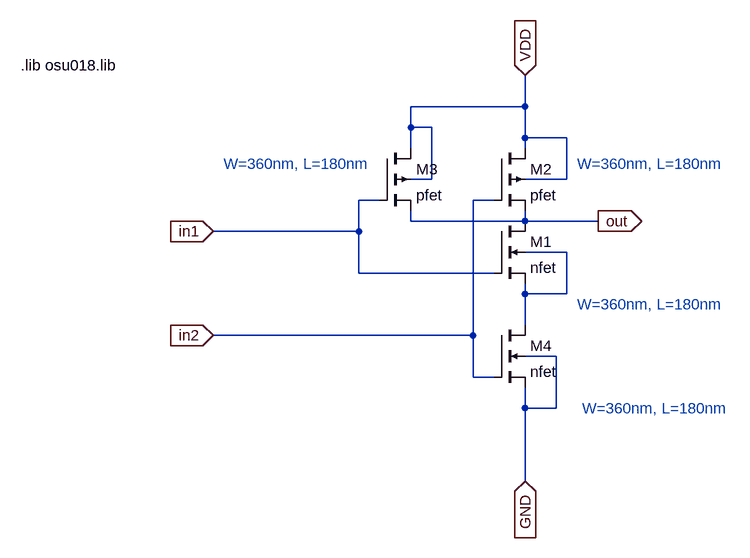
[diagram p0: schematic nand101.asc]
nand101.asc, the LTspice schematic file:
Version 4
SHEET 1 880 708
WIRE 272 0 272 -48
WIRE 272 0 96 0
WIRE 96 32 96 0
WIRE 128 32 96 32
WIRE 272 48 272 0
WIRE 336 48 272 48
WIRE 96 64 96 32
WIRE 272 64 272 48
WIRE 128 112 128 32
WIRE 128 112 96 112
WIRE 336 112 336 48
WIRE 336 112 272 112
WIRE 48 144 16 144
WIRE 224 144 192 144
WIRE 96 176 96 160
WIRE 272 176 272 160
WIRE 272 176 96 176
WIRE 384 176 272 176
WIRE 16 192 16 144
WIRE 16 192 -208 192
WIRE 336 224 272 224
WIRE 16 256 16 192
WIRE 224 256 16 256
WIRE 272 288 272 272
WIRE 336 288 336 224
WIRE 336 288 272 288
WIRE 272 336 272 288
WIRE 192 352 192 144
WIRE 192 352 -208 352
WIRE 320 384 272 384
WIRE 192 416 192 352
WIRE 224 416 192 416
WIRE 272 464 272 432
WIRE 320 464 320 384
WIRE 320 464 272 464
WIRE 272 576 272 464
FLAG 384 176 out
IOPIN 384 176 Out
FLAG -208 192 in1
IOPIN -208 192 In
FLAG 272 -48 VDD
IOPIN 272 -48 In
FLAG 272 576 GND
IOPIN 272 576 In
FLAG -208 352 in2
IOPIN -208 352 In
SYMBOL nmos4 224 176 R0
SYMATTR InstName M1
SYMATTR Value2 l=180n w=180n
SYMATTR Value nfet
SYMBOL pmos4 224 64 R0
SYMATTR InstName M2
SYMATTR Value2 l=180n w=360n
SYMATTR Value pfet
SYMBOL pmos4 48 64 R0
SYMATTR InstName M3
SYMATTR Value pfet
SYMATTR Value2 l=180n w=360n
SYMBOL nmos4 224 336 R0
SYMATTR InstName M4
SYMATTR Value nfet
SYMATTR Value2 l=180n w=360n
TEXT -504 -64 Left 2 !.lib osu018.lib
TEXT 352 304 Left 2 ;W=360nm, L=180nm
TEXT 352 88 Left 2 ;W=360nm, L=180nm
TEXT 360 464 Left 2 ;W=360nm, L=180nm
TEXT -192 88 Left 2 ;W=360nm, L=180nm

The netlist it stands for:
* nand101.asc
M1 out in1 N001 N001 nfet l=180n w=180n
M2 VDD in2 out VDD pfet l=180n w=360n
M3 VDD in1 out VDD pfet l=180n w=360n
M4 N001 in2 GND GND nfet l=180n w=360n
.model NMOS NMOS
.model PMOS PMOS
.lib standard.mos
.lib osu018.lib
* W=360nm, L=180nm
* W=360nm, L=180nm
* W=360nm, L=180nm
* W=360nm, L=180nm
.backanno
.end